# EAGLE design Enclosure 85x58 PBW (EAGLE 9.6.1)
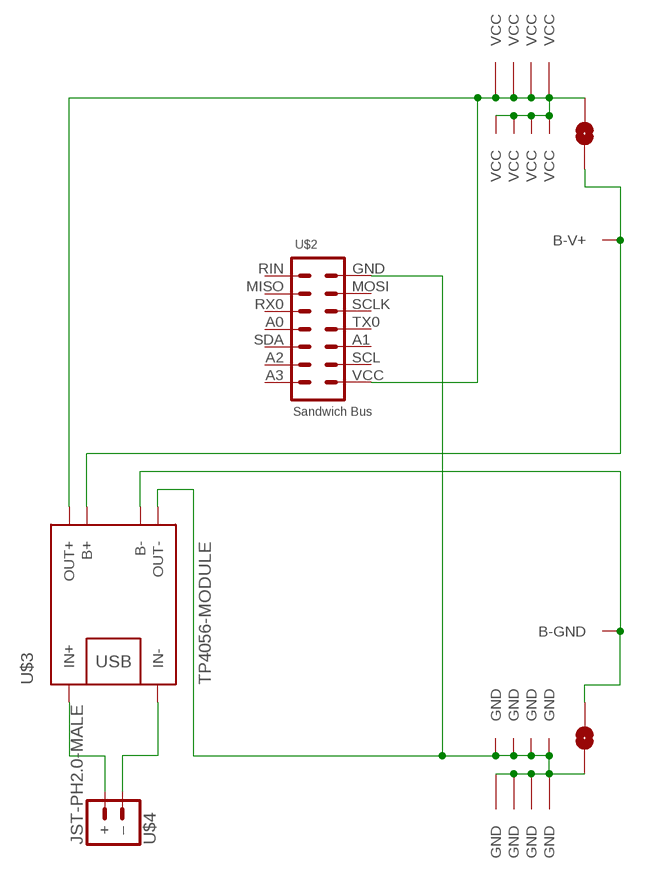
[diagram p0: schematic, sheet 1]

## Parts
U$1  PROTO-28X18-BAT2-SJ-W  [PROTO-28X18-BAT2-SJ-W]
U$2  Sandwich Bus  2X7-WIJNAND-PROCESSOR-HEADER  [CONN_2X7-WIJNAND-PROCESSOR]
U$3  TP4056-MODULE  [BATTERY-CHARGER-LI-PROT]
U$4  JST-PH2.0-MALE  [JST-PH2.0]

## Nets
GND: U$1.GND@SJ(GND) U$1.P27-11(GND) U$1.P27-12(GND) U$1.P27-13(GND) U$1.P27-14(GND) U$1.P28-11(GND) U$1.P28-12(GND) U$1.P28-13(GND) U$1.P28-14(GND) U$2.GND U$3.OUT-
N$3: U$1.B-GND@SJ(B-GND) U$1.P25-16(B-GND) U$3.B-
N$4: U$1.B-V+@SJ(B-V+) U$1.P03-16(B-V+) U$3.B+
N$5: U$3.IN+ U$4.+
N$6: U$3.IN- U$4.-(–)
VCC: U$1.P01-11(VCC) U$1.P01-12(VCC) U$1.P01-13(VCC) U$1.P01-14(VCC) U$1.P02-11(VCC) U$1.P02-12(VCC) U$1.P02-13(VCC) U$1.P02-14(VCC) U$1.VCC@SJ(VCC) U$2.VCC U$3.OUT+
Unconnected: U$2.A0 U$2.A1 U$2.A2 U$2.A3 U$2.MISO U$2.MOSI U$2.RIN U$2.RX0 U$2.SCL U$2.SCLK U$2.SDA U$2.TX0

## Library data of the parts
U$1 = digitalconcepts:PROTO-28X18-BAT2-SJ-W: 28 x 18 Prototyping board, with SJ between battery connections and GND/Vcc planes, to fit an 85 x 58 enclosure
U$2 = digitalconcepts:2X7-WIJNAND-PROCESSOR-HEADER: 2x7 Pin Header for Wijnand Arduino Pro Mini/RFM95W PCB
U$3 = digitalconcepts:TP4056-MODULE: Lithium Battery 5V Charger with protection circuit TP4056 Li Battery Charger module with PCB (rather than module) footprint More details available here: http://www.instructables.com/id/DIY-Lithium-ion-Battery-Charger/step4/TP4056-based-lithium-ion-battery-charger-module/ Click here to find device on ebay.com <http://www.ebay.com/sch/tp4056+charger+usb+protection>
U$4 = digitalconcepts:JST-PH2.0-MALE: PH2.0 Male PCB Connector

## Board
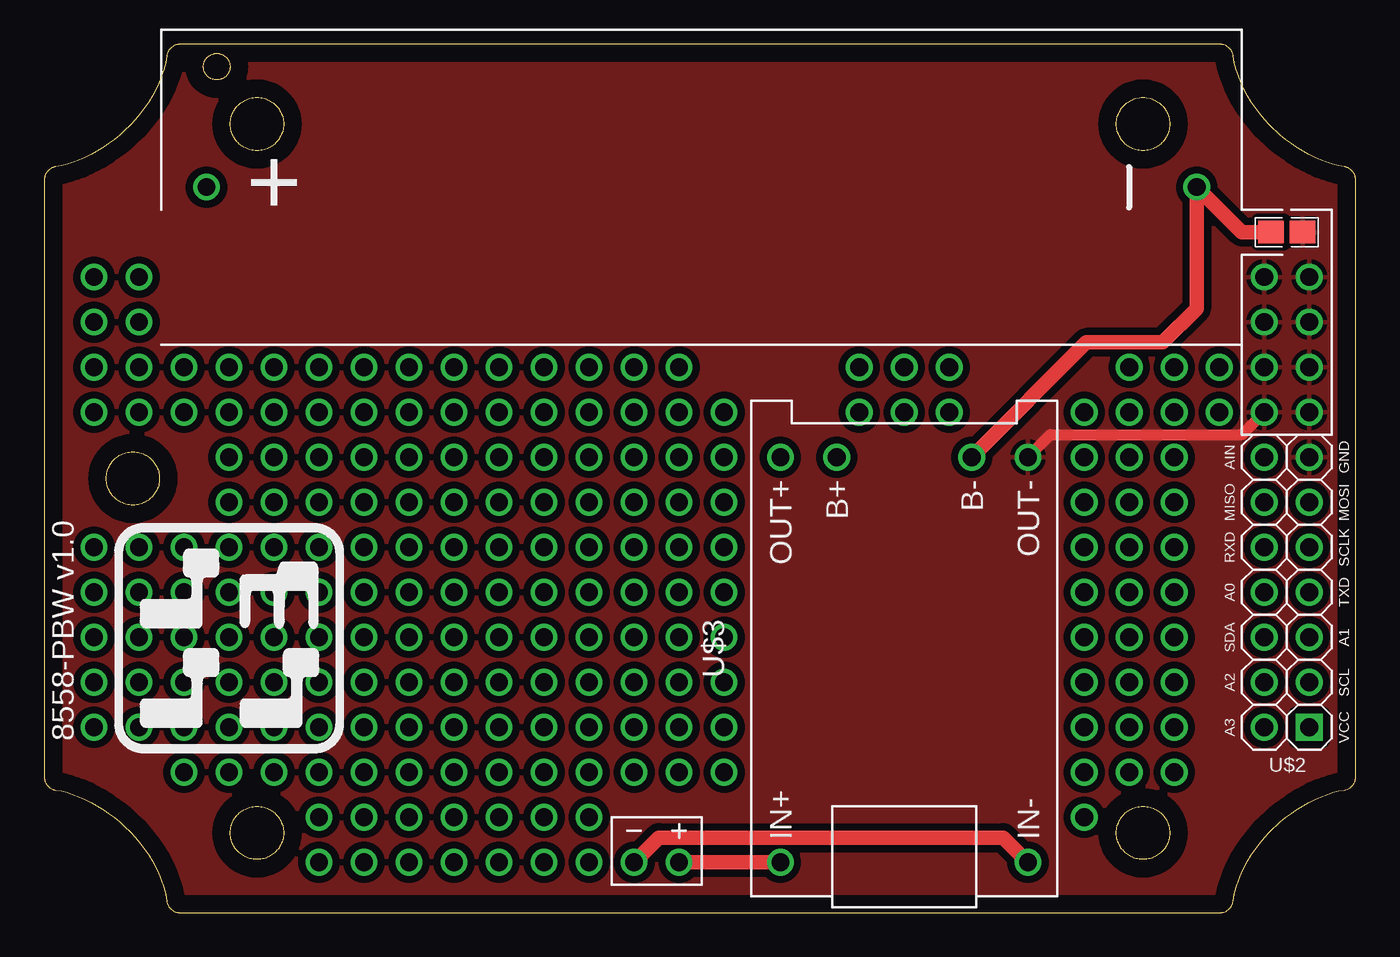
[diagram p1: board, top side]
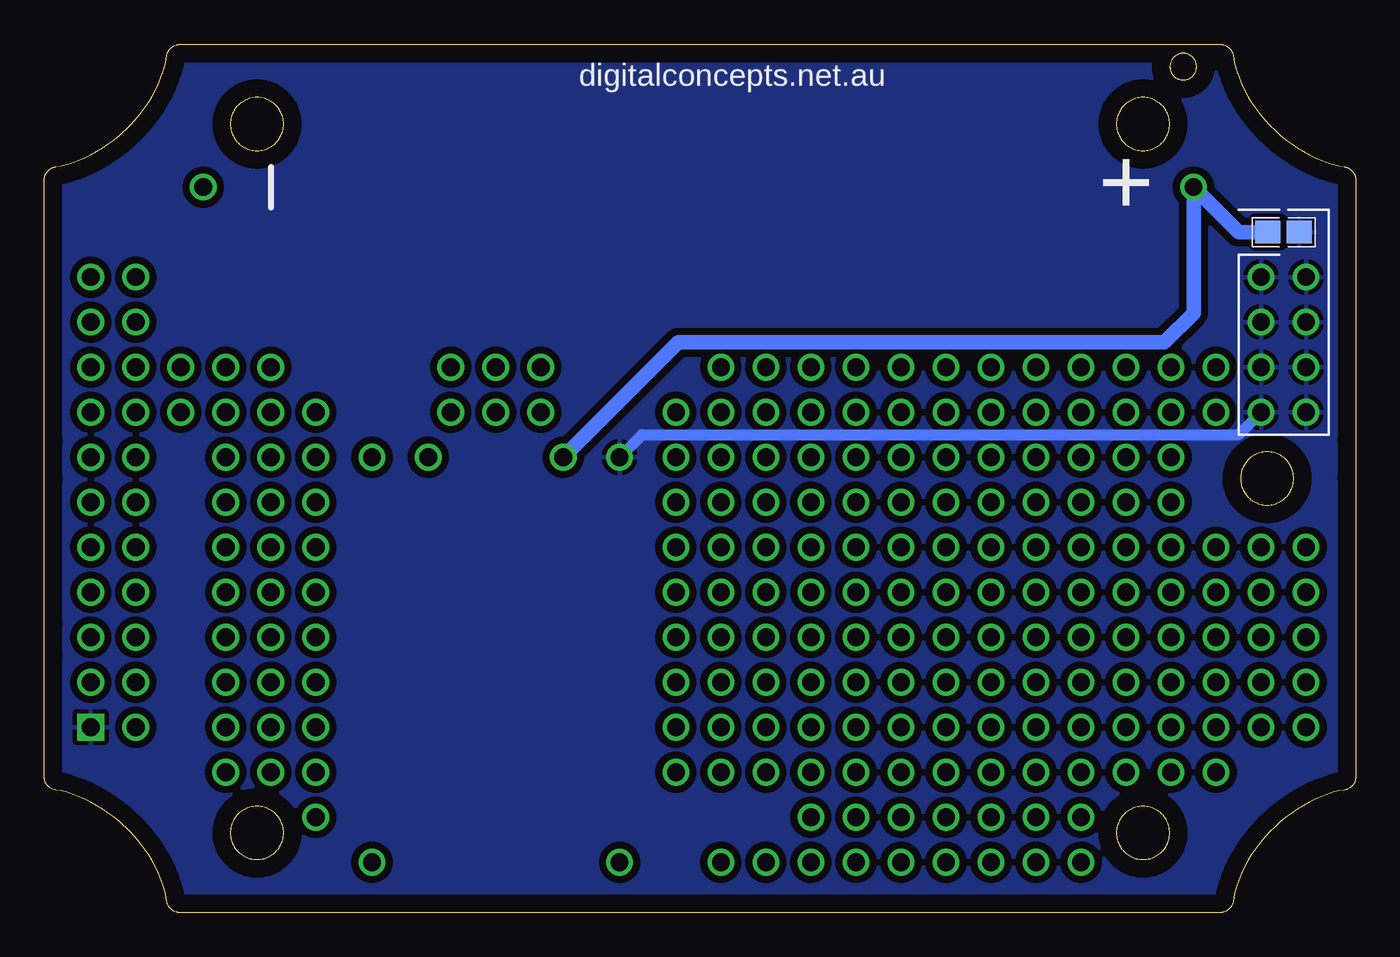
[diagram p2: board, bottom side, seen from below]

Size 74 x 49 mm. Coordinates in mm from the lower left corner, seen from the top.
Outline: 7.52,48.99 7.48,48.98 7.43,48.97 7.39,48.95 7.35,48.94 7.31,48.92 7.27,48.89 7.24,48.87 7.2,48.85 7.17,48.82 7.13,48.79 7.1,48.76 7.08,48.73 7.05,48.69 7.02,48.66 7,48.62 6.98,48.58 6.96,48.54 6.95,48.5 6.93,48.46 6.92,48.41 6.92,48.37 6.85,47.96 6.75,47.57 6.61,47.18 6.47,46.8 6.29,46.43 6.09,46.08 5.88,45.72 5.65,45.38 5.39,45.06 5.13,44.74 4.85,44.44 4.55,44.16 4.26,43.88 3.94,43.62 3.62,43.39 3.3,43.16 2.96,42.95 2.63,42.78 2.29,42.6 1.96,42.45 1.62,42.33 1.29,42.22 0.96,42.13 0.64,42.09 0.59,42.08 0.55,42.07 0.51,42.05 0.47,42.04 0.43,42.02 0.39,42 0.35,41.98 0.31,41.96 0.28,41.93 0.25,41.9 0.22,41.87 0.16,41.81 0.13,41.77 0.11,41.73 0.09,41.7 0.07,41.66 0.05,41.61 0.03,41.57 0.02,41.53 0.01,41.48 0,41.44 0,41.39 0,41.34 0,41.33 0,26.66 0,24.57 0,7.61 0,7.56 0.01,7.52 0.02,7.47 0.03,7.43 0.05,7.39 0.07,7.34 0.09,7.31 0.11,7.27 0.13,7.23 0.16,7.19 0.19,7.16 0.22,7.13 0.25,7.1 0.28,7.07 0.31,7.04 0.35,7.02 0.43,6.98 0.47,6.96 0.51,6.95 0.55,6.93 0.59,6.92 0.64,6.91 0.96,6.87 1.29,6.78 1.62,6.67 1.96,6.55 2.29,6.4 2.63,6.22 2.96,6.05 3.3,5.84 3.62,5.61 3.94,5.38 4.26,5.12 4.55,4.84 4.85,4.56 5.13,4.26 5.39,3.94 5.65,3.62 5.88,3.28 6.09,2.92 6.29,2.57 6.47,2.2 6.61,1.82 6.75,1.43 6.85,1.04 6.92,0.63 6.92,0.59 6.93,0.54 6.95,0.5 6.96,0.46 6.98,0.42 7,0.38 7.02,0.34 7.05,0.31 7.08,0.28 7.1,0.24 7.13,0.21 7.17,0.18 7.2,0.15 7.24,0.13 7.27,0.11 7.31,0.08 7.35,0.06 7.39,0.05 7.43,0.03 7.48,0.02 7.52,0.01 7.56,0 7.61,0 66.39,0 66.43,0 66.48,0.01 66.52,0.02 66.57,0.03 66.65,0.06 66.69,0.08 66.73,0.11 66.76,0.13 66.8,0.15 66.87,0.21 66.9,0.24 66.92,0.28 66.95,0.31 66.98,0.34 67.02,0.42 67.04,0.46 67.05,0.5 67.07,0.54 67.08,0.59 67.08,0.63 67.14,1.04 67.25,1.43 67.39,1.82 67.53,2.2 67.71,2.57 67.91,2.92 68.12,3.28 68.35,3.62 68.61,3.94 68.87,4.26 69.15,4.56 69.74,5.12 70.06,5.38 70.38,5.61 70.7,5.84 71.03,6.05 71.37,6.22 71.71,6.4 72.04,6.55 72.38,6.67 72.71,6.78 73.04,6.87 73.36,6.91 73.41,6.92 73.45,6.93 73.53,6.96 73.57,6.98 73.65,7.02 73.68,7.04 73.72,7.07 73.75,7.1 73.78,7.13 73.81,7.16 73.84,7.19 73.87,7.23 73.89,7.27 73.91,7.31 73.93,7.34 73.95,7.39 73.97,7.43 73.98,7.47 73.99,7.52 73.99,7.56 74,7.61 74,14.51 74,16.35 74,24.49 74,26.59 74,41.39 74,41.44 73.99,41.48 73.98,41.53 73.97,41.57 73.95,41.61 73.93,41.66 73.91,41.7 73.89,41.73 73.87,41.77 73.84,41.81 73.81,41.84 73.78,41.87 73.75,41.9 73.72,41.93 73.69,41.96 73.65,41.98 73.61,42 73.57,42.02 73.53,42.04 73.49,42.05 73.45,42.07 73.41,42.08 73.36,42.09 73.04,42.13 72.71,42.22 72.38,42.33 72.04,42.45 71.71,42.6 71.37,42.78 71.04,42.95 70.7,43.16 70.38,43.39 70.06,43.62 69.74,43.88 69.15,44.44 68.87,44.74 68.61,45.06 68.35,45.38 68.12,45.72 67.91,46.08 67.71,46.43 67.53,46.8 67.39,47.18 67.25,47.57 67.15,47.96 67.08,48.37 67.08,48.41 67.07,48.46 67.05,48.5 67.04,48.54 67.02,48.58 67,48.62 66.98,48.66 66.95,48.69 66.92,48.73 66.9,48.76 66.87,48.79 66.8,48.85 66.76,48.87 66.73,48.89 66.69,48.92 66.65,48.94 66.57,48.97 66.52,48.98 66.48,48.99 66.44,49 66.39,49 7.61,49 7.56,49 7.52,48.99
Outline: 62.3,5.97 62.4,5.95 62.49,5.92 62.58,5.88 62.67,5.84 62.76,5.8 62.84,5.74 62.92,5.69 62.99,5.63 63.13,5.49 63.19,5.42 63.24,5.34 63.3,5.26 63.34,5.17 63.38,5.08 63.42,4.99 63.45,4.9 63.47,4.8 63.49,4.71 63.5,4.6 63.5,4.4 63.49,4.3 63.47,4.2 63.45,4.1 63.42,4.01 63.38,3.92 63.34,3.83 63.3,3.74 63.24,3.66 63.19,3.58 63.13,3.51 62.99,3.37 62.92,3.31 62.84,3.26 62.76,3.2 62.67,3.16 62.58,3.12 62.49,3.08 62.4,3.05 62.3,3.03 62.2,3.01 62.1,3 61.9,3 61.8,3.01 61.7,3.03 61.6,3.05 61.51,3.08 61.42,3.12 61.33,3.16 61.24,3.2 61.08,3.31 61.01,3.37 60.87,3.51 60.81,3.58 60.76,3.66 60.7,3.74 60.66,3.83 60.62,3.92 60.58,4.01 60.55,4.1 60.53,4.2 60.51,4.3 60.5,4.4 60.5,4.6 60.51,4.71 60.53,4.8 60.55,4.9 60.58,4.99 60.62,5.08 60.66,5.17 60.7,5.26 60.76,5.34 60.81,5.42 60.87,5.49 61.01,5.63 61.08,5.69 61.16,5.74 61.24,5.8 61.33,5.84 61.42,5.88 61.51,5.92 61.6,5.95 61.7,5.97 61.8,5.99 61.9,6 62.1,6 62.2,5.99 62.3,5.97
Outline: 12.3,5.97 12.4,5.95 12.49,5.92 12.58,5.88 12.67,5.84 12.76,5.8 12.84,5.74 12.92,5.69 12.99,5.63 13.06,5.56 13.13,5.49 13.19,5.42 13.24,5.34 13.3,5.26 13.34,5.17 13.38,5.08 13.42,4.99 13.45,4.9 13.47,4.8 13.49,4.71 13.5,4.6 13.5,4.4 13.49,4.3 13.47,4.2 13.45,4.1 13.42,4.01 13.38,3.92 13.34,3.83 13.3,3.74 13.24,3.66 13.19,3.58 13.13,3.51 13.06,3.44 12.99,3.37 12.92,3.31 12.84,3.26 12.76,3.2 12.67,3.16 12.58,3.12 12.49,3.08 12.4,3.05 12.3,3.03 12.2,3.01 12.1,3 11.9,3 11.8,3.01 11.7,3.03 11.6,3.05 11.51,3.08 11.33,3.16 11.24,3.2 11.08,3.31 11.01,3.37 10.94,3.44 10.87,3.51 10.81,3.58 10.76,3.66 10.7,3.74 10.66,3.83 10.62,3.92 10.58,4.01 10.55,4.1 10.53,4.2 10.51,4.3 10.5,4.4 10.5,4.6 10.51,4.71 10.53,4.8 10.55,4.9 10.58,4.99 10.62,5.08 10.66,5.17 10.7,5.26 10.76,5.34 10.81,5.42 10.87,5.49 10.94,5.56 11.01,5.63 11.08,5.69 11.16,5.74 11.24,5.8 11.33,5.84 11.51,5.92 11.6,5.95 11.7,5.97 11.8,5.99 11.9,6 12.1,6 12.2,5.99 12.3,5.97
Outline: 5.3,25.97 5.4,25.95 5.49,25.92 5.58,25.88 5.67,25.84 5.76,25.8 5.84,25.74 5.92,25.69 5.99,25.63 6.13,25.49 6.19,25.42 6.24,25.34 6.3,25.26 6.34,25.17 6.38,25.08 6.42,24.99 6.45,24.9 6.47,24.8 6.49,24.7 6.5,24.6 6.5,24.4 6.49,24.3 6.47,24.2 6.45,24.1 6.42,24.01 6.38,23.92 6.34,23.83 6.3,23.74 6.24,23.66 6.19,23.58 6.13,23.51 6.06,23.44 5.99,23.37 5.92,23.31 5.84,23.26 5.76,23.2 5.67,23.16 5.58,23.12 5.49,23.08 5.4,23.05 5.3,23.03 5.2,23.01 5.1,23 4.9,23 4.79,23.01 4.7,23.03 4.6,23.05 4.51,23.08 4.42,23.12 4.33,23.16 4.24,23.2 4.16,23.26 4.08,23.31 4.01,23.37 3.94,23.44 3.87,23.51 3.81,23.58 3.76,23.66 3.7,23.74 3.66,23.83 3.62,23.92 3.58,24.01 3.55,24.1 3.53,24.2 3.51,24.3 3.5,24.4 3.5,24.6 3.51,24.7 3.53,24.8 3.55,24.9 3.58,24.99 3.62,25.08 3.66,25.17 3.7,25.26 3.76,25.34 3.81,25.42 3.87,25.49 4.01,25.63 4.08,25.69 4.16,25.74 4.24,25.8 4.33,25.84 4.42,25.88 4.51,25.92 4.6,25.95 4.7,25.97 4.79,25.99 4.9,26 5.1,26 5.2,25.99 5.3,25.97
Outline: 62.4,45.95 62.49,45.92 62.58,45.88 62.67,45.84 62.76,45.8 62.84,45.74 62.92,45.69 62.99,45.63 63.06,45.56 63.13,45.49 63.19,45.42 63.24,45.34 63.3,45.26 63.34,45.17 63.38,45.08 63.42,44.99 63.45,44.9 63.47,44.8 63.49,44.7 63.5,44.6 63.5,44.4 63.49,44.3 63.47,44.2 63.45,44.1 63.42,44.01 63.38,43.92 63.34,43.83 63.3,43.74 63.24,43.66 63.19,43.58 63.13,43.51 63.06,43.44 62.99,43.37 62.92,43.31 62.84,43.26 62.76,43.2 62.67,43.16 62.58,43.12 62.49,43.08 62.4,43.05 62.3,43.03 62.2,43.01 62.1,43 61.9,43 61.8,43.01 61.7,43.03 61.6,43.05 61.51,43.08 61.42,43.12 61.33,43.16 61.24,43.2 61.16,43.26 61.08,43.31 61.01,43.37 60.87,43.51 60.81,43.58 60.76,43.66 60.7,43.74 60.66,43.83 60.62,43.92 60.58,44.01 60.55,44.1 60.53,44.2 60.51,44.3 60.5,44.4 60.5,44.6 60.51,44.7 60.53,44.8 60.55,44.9 60.58,44.99 60.62,45.08 60.66,45.17 60.7,45.26 60.76,45.34 60.81,45.42 60.87,45.49 61.01,45.63 61.08,45.69 61.16,45.74 61.24,45.8 61.33,45.84 61.42,45.88 61.51,45.92 61.6,45.95 61.8,45.99 61.9,46 62.1,46 62.2,45.99 62.4,45.95
Outline: 12.3,45.97 12.4,45.95 12.49,45.92 12.58,45.88 12.67,45.84 12.76,45.8 12.84,45.74 12.92,45.69 12.99,45.63 13.06,45.56 13.13,45.49 13.19,45.42 13.24,45.34 13.3,45.26 13.34,45.17 13.38,45.08 13.42,44.99 13.45,44.9 13.47,44.8 13.49,44.7 13.5,44.6 13.5,44.4 13.49,44.3 13.47,44.2 13.45,44.1 13.42,44.01 13.38,43.92 13.34,43.83 13.3,43.74 13.24,43.66 13.19,43.58 13.13,43.51 13.06,43.44 12.99,43.37 12.92,43.31 12.84,43.26 12.76,43.2 12.67,43.16 12.58,43.12 12.49,43.08 12.4,43.05 12.3,43.03 12.2,43.01 12.1,43 11.9,43 11.8,43.01 11.7,43.03 11.6,43.05 11.51,43.08 11.33,43.16 11.24,43.2 11.16,43.26 11.08,43.31 11.01,43.37 10.94,43.44 10.87,43.51 10.81,43.58 10.76,43.66 10.7,43.74 10.66,43.83 10.62,43.92 10.58,44.01 10.55,44.1 10.53,44.2 10.51,44.3 10.5,44.4 10.5,44.6 10.51,44.7 10.53,44.8 10.55,44.9 10.58,44.99 10.62,45.08 10.66,45.17 10.7,45.26 10.76,45.34 10.81,45.42 10.87,45.49 10.94,45.56 11.01,45.63 11.08,45.69 11.16,45.74 11.24,45.8 11.33,45.84 11.51,45.92 11.6,45.95 11.7,45.97 11.8,45.99 11.9,46 12.1,46 12.2,45.99 12.3,45.97
Outline: 9.88,48.47 9.93,48.46 9.98,48.45 10.02,48.43 10.07,48.41 10.11,48.39 10.15,48.36 10.19,48.33 10.23,48.3 10.26,48.27 10.29,48.24 10.32,48.2 10.35,48.16 10.38,48.12 10.4,48.08 10.42,48.03 10.44,47.99 10.45,47.94 10.46,47.89 10.47,47.84 10.48,47.79 10.48,47.69 10.47,47.64 10.46,47.59 10.45,47.54 10.44,47.49 10.42,47.45 10.4,47.4 10.38,47.36 10.35,47.32 10.32,47.28 10.29,47.24 10.26,47.21 10.23,47.18 10.19,47.14 10.15,47.12 10.11,47.09 10.07,47.07 10.02,47.05 9.98,47.03 9.93,47.01 9.88,47 9.83,46.99 9.78,46.99 9.68,46.99 9.63,46.99 9.58,47 9.53,47.01 9.48,47.03 9.39,47.07 9.35,47.09 9.31,47.12 9.27,47.14 9.23,47.18 9.2,47.21 9.17,47.24 9.13,47.28 9.11,47.32 9.08,47.36 9.06,47.4 9.04,47.45 9.02,47.49 9.01,47.54 9,47.59 8.99,47.64 8.98,47.69 8.98,47.79 8.99,47.84 9,47.89 9.01,47.94 9.02,47.99 9.04,48.03 9.06,48.08 9.08,48.12 9.11,48.16 9.13,48.2 9.17,48.24 9.2,48.27 9.23,48.3 9.27,48.33 9.31,48.36 9.35,48.39 9.39,48.41 9.44,48.43 9.48,48.45 9.53,48.46 9.58,48.47 9.63,48.48 9.68,48.49 9.78,48.49 9.83,48.48 9.88,48.47
Copper layers (1*16): Top 0.035mm / dielectric 1.5mm / Bottom 0.035mm
Design rules "default": minimum track width 6mil, minimum drill 0.35mm, track to track 6mil, track to pad 6mil, pad to pad 6mil, via to via 6mil, smd to smd 6mil, copper to edge 40mil, drill to drill 6mil, minimum pad ring 10mil, minimum via ring 8mil, stop-mask expansion 4mil, vias tented up to drill 0mil, thermal gap 10mil

### Footprints (pad centres in the part's own frame; a part is rotated, then mirrored left to right if it is on the bottom)
PROTO-28X18-BAT2-SJ-W = smd 1.422 x 1.27: B-GND@SJ 32.131,13.97; GND@SJ 33.909,13.97 | smd 1.422 x 1.27 bottom: B-V+@SJ -32.131,13.97; VCC@SJ -33.909,13.97 | drill 1: P01-04 -34.29,-13.97; P01-05 -34.29,-11.43; P01-06 -34.29,-8.89; P01-07 -34.29,-6.35; P01-08 -34.29,-3.81; P01-11 -34.29,3.81; P01-12 -34.29,6.35; P01-13 -34.29,8.89; P01-14 -34.29,11.43; P02-04 -31.75,-13.97; P02-05 -31.75,-11.43; P02-06 -31.75,-8.89; P02-07 -31.75,-6.35; P02-08 -31.75,-3.81; P02-11 -31.75,3.81; P02-12 -31.75,6.35; P02-13 -31.75,8.89; P02-14 -31.75,11.43; P03-03 -29.21,-16.51; P03-04 -29.21,-13.97; P03-05 -29.21,-11.43; P03-06 -29.21,-8.89; P03-07 -29.21,-6.35; P03-08 -29.21,-3.81; P03-11 -29.21,3.81; P03-12 -29.21,6.35; P03-16 -27.94,16.51; P04-03 -26.67,-16.51; P04-04 -26.67,-13.97; P04-05 -26.67,-11.43; P04-06 -26.67,-8.89; P04-07 -26.67,-6.35; P04-08 -26.67,-3.81; P04-09 -26.67,-1.27; P04-10 -26.67,1.27; P04-11 -26.67,3.81; P04-12 -26.67,6.35; P05-03 -24.13,-16.51; P05-04 -24.13,-13.97; P05-05 -24.13,-11.43; P05-06 -24.13,-8.89; P05-07 -24.13,-6.35; P05-08 -24.13,-3.81; P05-09 -24.13,-1.27; P05-10 -24.13,1.27; P05-11 -24.13,3.81; P05-12 -24.13,6.35; P06-01 -21.59,-21.59; P06-02 -21.59,-19.05; P06-03 -21.59,-16.51; P06-04 -21.59,-13.97; P06-05 -21.59,-11.43; P06-06 -21.59,-8.89; P06-07 -21.59,-6.35; P06-08 -21.59,-3.81; P06-09 -21.59,-1.27; P06-10 -21.59,1.27; P06-11 -21.59,3.81; P06-12 -21.59,6.35; P07-01 -19.05,-21.59; P07-02 -19.05,-19.05; P07-03 -19.05,-16.51; P07-04 -19.05,-13.97; P07-05 -19.05,-11.43; P07-06 -19.05,-8.89; P07-07 -19.05,-6.35; P07-08 -19.05,-3.81; P07-09 -19.05,-1.27; P07-10 -19.05,1.27; P07-11 -19.05,3.81; P07-12 -19.05,6.35; P08-01 -16.51,-21.59; P08-02 -16.51,-19.05; P08-03 -16.51,-16.51; P08-04 -16.51,-13.97; P08-05 -16.51,-11.43; P08-06 -16.51,-8.89; P08-07 -16.51,-6.35; P08-08 -16.51,-3.81; P08-09 -16.51,-1.27; P08-10 -16.51,1.27; P08-11 -16.51,3.81; P08-12 -16.51,6.35; P09-01 -13.97,-21.59; P09-02 -13.97,-19.05; P09-03 -13.97,-16.51; P09-04 -13.97,-13.97; P09-05 -13.97,-11.43; P09-06 -13.97,-8.89; P09-07 -13.97,-6.35; P09-08 -13.97,-3.81; P09-09 -13.97,-1.27; P09-10 -13.97,1.27; P09-11 -13.97,3.81; P09-12 -13.97,6.35; P10-01 -11.43,-21.59; P10-02 -11.43,-19.05; P10-03 -11.43,-16.51; P10-04 -11.43,-13.97; P10-05 -11.43,-11.43; P10-06 -11.43,-8.89; P10-07 -11.43,-6.35; P10-08 -11.43,-3.81; P10-09 -11.43,-1.27; P10-10 -11.43,1.27; P10-11 -11.43,3.81; P10-12 -11.43,6.35; P11-01 -8.89,-21.59; P11-02 -8.89,-19.05; P11-03 -8.89,-16.51; P11-04 -8.89,-13.97; P11-05 -8.89,-11.43; P11-06 -8.89,-8.89; P11-07 -8.89,-6.35; P11-08 -8.89,-3.81; P11-09 -8.89,-1.27; P11-10 -8.89,1.27; P11-11 -8.89,3.81; P11-12 -8.89,6.35; P12-01 -6.35,-21.59; P12-02 -6.35,-19.05; P12-03 -6.35,-16.51; P12-04 -6.35,-13.97; P12-05 -6.35,-11.43; P12-06 -6.35,-8.89; P12-07 -6.35,-6.35; P12-08 -6.35,-3.81; P12-09 -6.35,-1.27; P12-10 -6.35,1.27; P12-11 -6.35,3.81; P12-12 -6.35,6.35; P13-03 -3.81,-16.51; P13-04 -3.81,-13.97; P13-05 -3.81,-11.43; P13-06 -3.81,-8.89; P13-07 -3.81,-6.35; P13-08 -3.81,-3.81; P13-09 -3.81,-1.27; P13-10 -3.81,1.27; P13-11 -3.81,3.81; P13-12 -3.81,6.35; P14-03 -1.27,-16.51; P14-04 -1.27,-13.97; P14-05 -1.27,-11.43; P14-06 -1.27,-8.89; P14-07 -1.27,-6.35; P14-08 -1.27,-3.81; P14-09 -1.27,-1.27; P14-10 -1.27,1.27; P14-11 -1.27,3.81; P14-12 -1.27,6.35; P15-03 1.27,-16.51; P15-04 1.27,-13.97; P15-05 1.27,-11.43; P15-06 1.27,-8.89; P15-07 1.27,-6.35; P15-08 1.27,-3.81; P15-09 1.27,-1.27; P15-10 1.27,1.27; P15-11 1.27,3.81; P18-11 8.89,3.81; P18-12 8.89,6.35; P19-11 11.43,3.81; P19-12 11.43,6.35; P20-11 13.97,3.81; P20-12 13.97,6.35; P23-02 21.59,-19.05; P23-03 21.59,-16.51; P23-04 21.59,-13.97; P23-05 21.59,-11.43; P23-06 21.59,-8.89; P23-07 21.59,-6.35; P23-08 21.59,-3.81; P23-09 21.59,-1.27; P23-10 21.59,1.27; P23-11 21.59,3.81; P24-03 24.13,-16.51; P24-04 24.13,-13.97; P24-05 24.13,-11.43; P24-06 24.13,-8.89; P24-07 24.13,-6.35; P24-08 24.13,-3.81; P24-09 24.13,-1.27; P24-10 24.13,1.27; P24-11 24.13,3.81; P24-12 24.13,6.35; P25-03 26.67,-16.51; P25-04 26.67,-13.97; P25-05 26.67,-11.43; P25-06 26.67,-8.89; P25-07 26.67,-6.35; P25-08 26.67,-3.81; P25-09 26.67,-1.27; P25-10 26.67,1.27; P25-11 26.67,3.81; P25-12 26.67,6.35; P25-16 27.94,16.51; P26-11 29.21,3.81; P26-12 29.21,6.35; P27-11 31.75,3.81; P27-12 31.75,6.35; P27-13 31.75,8.89; P27-14 31.75,11.43; P28-11 34.29,3.81; P28-12 34.29,6.35; P28-13 34.29,8.89; P28-14 34.29,11.43
CONN_2X7-WIJNAND-PROCESSOR = drill 1 pad 1.524: A0 7.62,2.54; A1 5.08,0; A2 2.54,2.54; A3 0,2.54; GND 15.24,0; MISO 12.7,2.54; MOSI 12.7,0; RIN 15.24,2.54; RX0 10.16,2.54; SCL 2.54,0; SCLK 10.16,0; SDA 5.08,2.54; TX0 7.62,0 | drill 1 pad 1.524 square: VCC 0,0
BATTERY-CHARGER-LI-PROT = drill 1: B+ 10.795,3.81; B- 10.795,-3.81; IN+ -12.065,6.985; IN- -12.065,-6.985; OUT+ 10.795,6.985; OUT- 10.795,-6.985
JST-PH2.0 = drill 1: + -1.27,0; - 1.27,0

### Placement (x,y rotation side)
U$1  37.09,24.43 0 top
U$2  71.38,10.46 90 top
U$3  48.52,14.91 90 top
U$4  34.55,2.84 180 top

### Tracks (layer width: path | path; a pad name or v marks a point on that pad's centre or on a via)
GND
  Top 0.61: U$3.OUT- 56.78,26.97 67.57,26.97 U$1.P27-11
  pour Top (isolate 0.406): -1.26,50.34 75.19,50.34 75.19,-1.48 -1.26,-1.48
N$3
  Top 0.813: U$1.B-GND@SJ 67.57,38.4 U$1.P25-16 65.03,34.08 63.13,32.18 58.81,32.18 U$3.B-
N$4
  Bottom 0.813: U$1.B-V+@SJ 6.61,38.4 U$1.P03-16 9.15,33.83 10.8,32.18 38.23,32.18 U$3.B+
N$5
  Top 0.813: U$4.+ U$3.IN+
N$6
  Top 0.813: U$4.- 34.68,4.24 54.11,4.24 U$3.IN-
VCC
  Bottom 0.61: U$3.OUT+ 40.27,26.97 6.61,26.97 U$1.P02-11
  pour Bottom (isolate 0.406): 0.01,49.07 73.92,49.07 73.92,-0.21 0.01,-0.21

### Text on the board
tPlace: + | AIN | GND | MISO | MOSI | RXD | SCLK | A0 | TXD | 8558-PBW v1.0 | SDA | A1 | A2 | SCL | A3 | VCC
bPlace: digitalconcepts.net.au | +